# Altium schematic sheet CH340G.SchDoc
size A
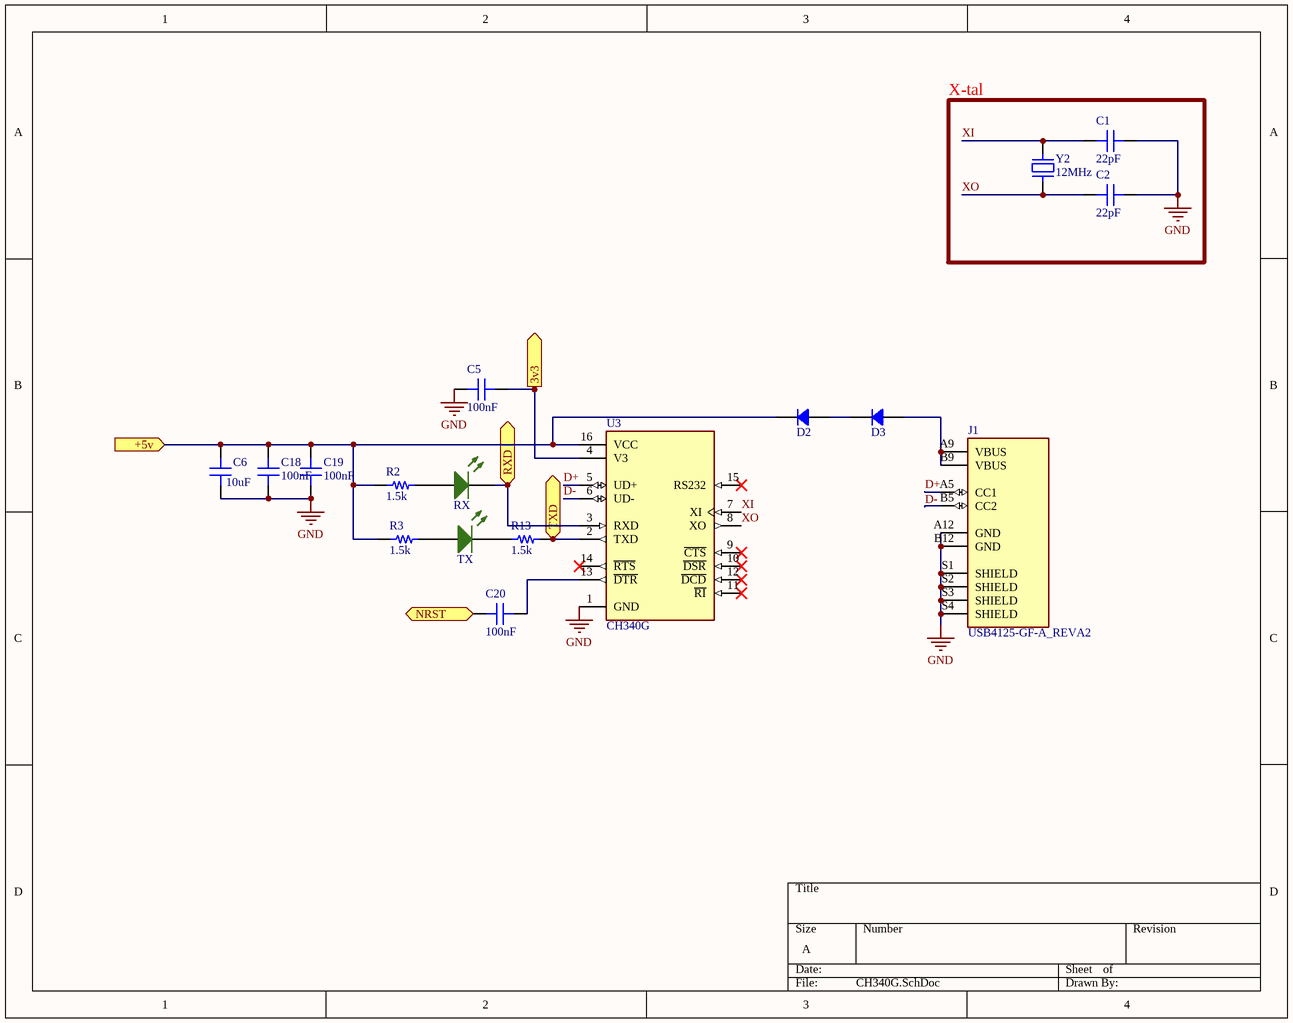
[diagram p0: CH340G.SchDoc]

## Parts
C1  22pF  [CAP 0805_2012]
C2  22pF  [CAP 0805_2012]
C5  100nF  [CAP 0805_2012]
C6  10uF  [CAP 0805_2012]
C18  100nF  [CAP 0805_2012]
C19  100nF  [CAP 0805_2012]
C20  100nF  [CAP 0805_2012]
D2  1N4148  [SOD-523F]  (value not drawn)
D3  1N4148  [SOD-523F]  (value not drawn)
J1  USB4125-GF-A_REVA2  [GCT_USB4125-GF-A_REVA2]
R2  1.5k  [RES 0805_2012]
R3  1.5k  [RES 0805_2012]
R13  1.5k  [RES 0805_2012]
RX  LED SMD 0805 GREEN  [LED_0805_GREEN]  (value not drawn)
TX  LED SMD 0805 GREEN  [LED_0805_GREEN]  (value not drawn)
U3  CH340G  [SOIC127P600X180-16N]
Y2  12MHz  [HC-49S SMD]

## Blocks framed on the sheet
X-tal: C1 C2 Y2

## Ports
3v3 (out), +5v (in), NRST (bidir), RXD (bidir), TXD (bidir)

## Nets
GND: C1.2 C2.2 C5.1 C6.1 C18.1 C19.1 J1.A12(GND) J1.B12(GND) J1.S1(SHIELD) J1.S2(SHIELD) J1.S3(SHIELD) J1.S4(SHIELD) U3.1(GND)
3v3: C5.2 U3.4(V3) ; port 3v3
+5v: C6.2 C18.2 C19.2 D2.2 R2.1 R3.1 U3.16(VCC) ; port +5v
D+: J1.A5(CC1) U3.5(UD+)
D-: J1.B5(CC2) U3.6(UD-)
NRST: C20.1 ; port NRST
RXD: RX.2(K) U3.3(RXD) ; port RXD
TXD: R13.2 U3.2(TXD) ; port TXD
XI: C1.1 U3.7(XI) Y2.2
XO: C2.1 U3.8(XO) Y2.1
NetC20_2: C20.2 U3.13(~{DTR})
NetD2_1: D2.1 D3.2
NetD3_1: D3.1 J1.A9(VBUS) J1.B9(VBUS)
NetR2_2: R2.2 RX.1(A)
NetR3_2: R3.2 TX.1(A)
NetR13_1: R13.1 TX.2(K)

Not connected (* = marked no-connect by the designer): U3 9(~{CTS})* 10(~{DSR})* 11(~{RI})* 12(~{DCD})* 14(~{RTS})* 15(RS232)*

## Library data of the parts
C1 C2 C6 = Cap 0805: SMT Capacitor; VALUE: 100nF
C5 C18-C20 = Cap 0805: SMT Capacitor; VALUE: 100nF
D2 D3 = 1N4148 (SMD): Diode Standard 75V 200mA Surface Mount SOD-523F; PartNumber: 1N4148WT
R2 R3 R13 = Res 0805: SMT Resistor; VALUE: 1K
U3 = CH340G: USB Interface Integrated Circuit; MF: WCH; Value: *; SnapEDA_Link: https://www.snapeda.com/parts/Ch340G/WCH/view-part/?ref=snap; MP: Ch340G; Check_prices: https://www.snapeda.com/parts/Ch340G/WCH/view-part/?ref=eda; Availability: Not in stock; Price: None; Package: None
Y2 = Crystal HC-49S SMD 8MHz: SMT Crystal; PartNumber: ABLS-8.000MHZ-K4T
J1 = USB4125-GF-A_REVA2: Package: None; Availability: Unavailable; MP: USB4125-GF-A_REVA2; Value: *; Price: None